# Altium schematic sheet RECEPTOR.SchDoc
size A
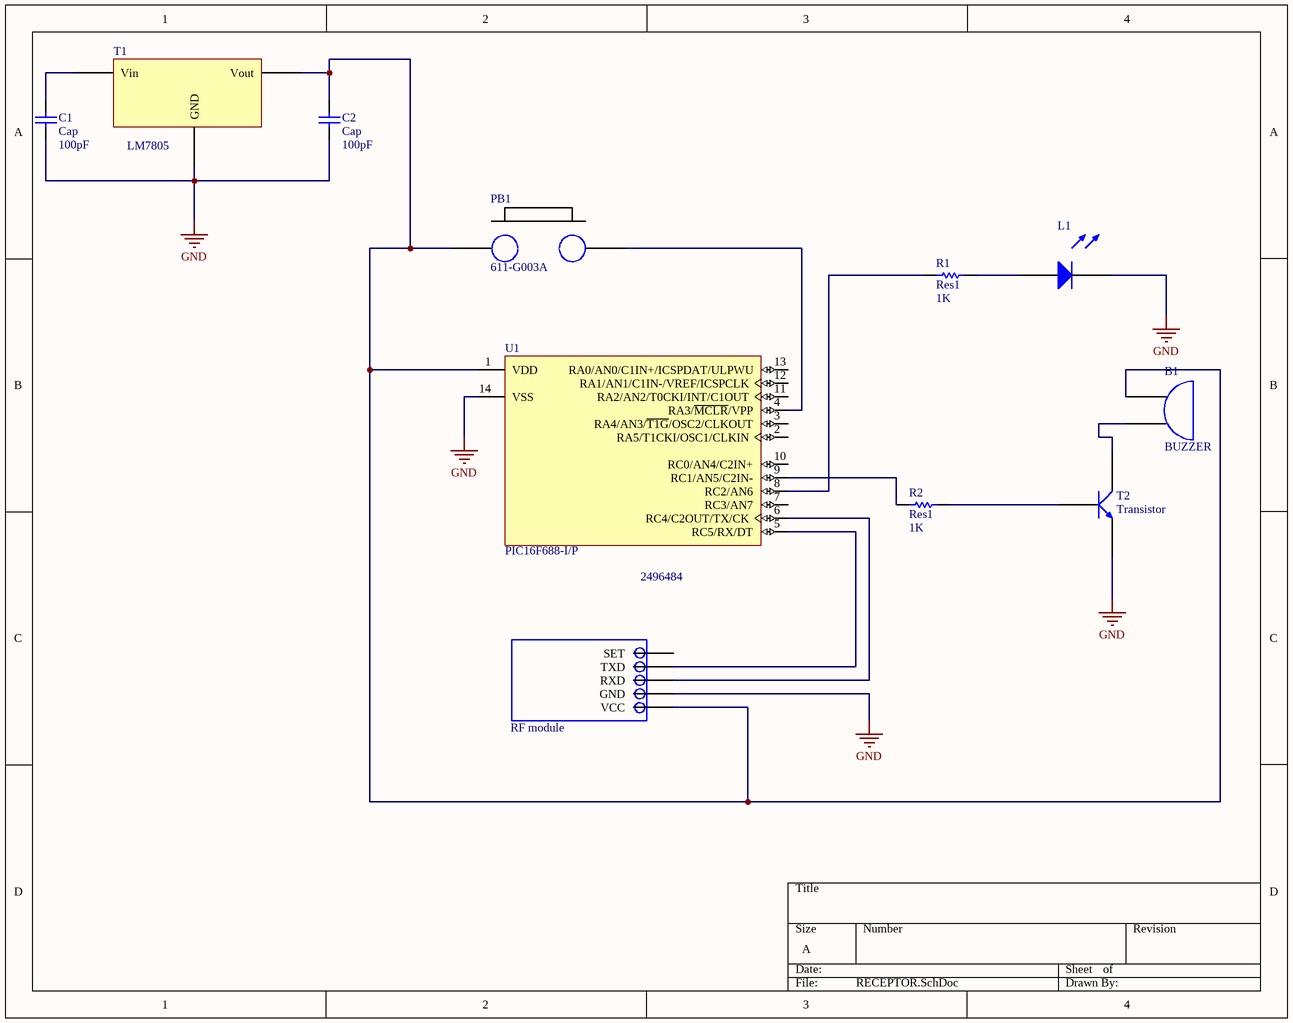
[diagram p0: RECEPTOR.SchDoc]

## Parts
B1  BUZZER  [Buzzer]
C1  Cap  value 100pF  [RAD-0.3]
C2  Cap  value 100pF  [RAD-0.3]
L1  LED  [LED]  (value not drawn)
PB1  Supplier Part Number 1: 611-G003A  [Push Button]  (hidden comment: Push Button 2-Pin)
R1  Res1  value 1K  [AXIAL-0.3]
R2  Res1  value 1K  [AXIAL-0.3]
T1  LM7805  [LM7805]
T2  Transistor  [2N2222a]
U1  PIC16F688-I/P  [PDIP300-P14]
U2  RF module  Supplier Part Number 1: 2496484  [HC-12]

## Nets
GND: C1.1 C2.1 L1.2 T1.174(GND) T2.34(E) U1.14(VSS) U2.4(GND)
NetB1_1: B1.1(VCC) C2.2 PB1.1 T1.175(Vout) U1.1(VDD) U2.5(VCC)
NetB1_36: B1.36(VEE) T2.1(C)
NetC1_2: C1.2 T1.173(Vin)
NetL1_1: L1.1 R1.2
NetPB1_2: PB1.2 U1.4(RA3/~{MCLR}/VPP)
NetR1_1: R1.1 U1.8(RC2/AN6)
NetR2_1: R2.1 U1.9(RC1/AN5/C2IN-)
NetR2_2: R2.2 T2.33(B)
NetU1_5: U1.5(RC5/RX/DT) U2.2(TXD)
NetU1_6: U1.6(RC4/C2OUT/TX/CK) U2.3(RXD)

Not connected (* = marked no-connect by the designer): U1 2(RA5/T1CKI/OSC1/CLKIN) 3(RA4/AN3/~{T1G}/OSC2/CLKOUT) 7(RC3/AN7) 10(RC0/AN4/C2IN+) 11(RA2/AN2/T0CKI/INT/C1OUT) 12(RA1/AN1/C1IN-/VREF/ICSPCLK) 13(RA0/AN0/C1IN+/ICSPDAT/ULPWU); U2 1(SET)

## Library data of the parts
B1 = BUZZER: Buzzer 3-12V; Manufacturer: Murata; Manufacturer Part Number: PKB24SPCH3601-B0; Frequency: 3.6kHz; Max Supply Voltage: 15V; Voltage Rating: 12V; Min Supply Voltage: 3V; Max Frequency: 4.1kHz; Nominal Supply Current: 16mA; Washable: No; Supplier 1: RSComponents; Stock 1: 0; Mount: Flush,PCB,Through Hole; Min Operating Temperature: -20°C; Max Operating Temperature: 70°C; Termination: PC Pins; Self Resonant Frequency: 3.6kHz; Package Quantity: 650; Packaging: Bulk; Voltage Rating (DC): 15V; Nominal Supply Voltage (DC): 12V; Max Supply Voltage (DC): 15V; Min Supply Voltage (DC): 3V; Operating Supply Current: 16mA; Max Supply Current: 16mA; Diameter: 24.3mm; Length: 24.3mm; Height: 9.7mm; Radiation Hardening: No; REACH SVHC: No SVHC; Lead Free: Lead Free; Supplier Part Number 1: 5168274P
C1 C2 = Cap: Capacitor Ceramico; Manufacturer: KEMET; Manufacturer Part Number: C0402C104K8PACTU; Capacitance: 100nF; Tolerance: 10%; Voltage Rating: 10V; Dielectric: X5R; Dissipation Factor: 5%; Published: 8-Jun-2000; LatestRevisionDate: 17-Jul-2002; LatestRevisionNote: Re-released for DXP Platform.; PackageReference: RAD-0.3; Publisher: Altium Limited; PackageDescription: Radial Cap, Thru-Hole; 2 Leads; 0.3 in Pin Spacing; Supplier 1: Arrow; Stock 1: 0; Mount: PCB,Surface Mount; Case/Package: 0402; Number of Pins: 2; Case Code (Metric): 1005; Case Code (Imperial): 0402; Dielectric Material: Ceramic; Contact Plating: Matte,Tin; Min Operating Temperature: -55°C; Max Operating Temperature: 85°C; Voltage Rating (DC): 10V; Package Quantity: 1; Packaging: Tape and Reel; Termination: SMD/SMT; Voltage: 10V; Length: 1mm; Height: 0.5mm; Width: 0.02inch; Depth: 0.5mm; Thickness: 0.022inch; Lead Pitch: 0.3mm; Radiation Hardening: No; REACH SVHC: No SVHC; Lead Free: Lead Free; Supplier Part Number 1: C0402C104K8PAC7867
L1 = LED: Manufacturer: Vishay Lite-On; Manufacturer Part Number: LTST-C190GKT; Colour: Green; Lens Colour: Clear,Colorless; Luminous Intensity: 6mcd; Forward Voltage: 2.1V; Viewing Angle: 130°; Lens Style: Clear,Colorless,Diffused,Rectangular; Forward Current: 30mA; Test Current: 10mA; Number of Elements: 1; Power Dissipation: 100mW; Reverse Voltage: 5V; Dominant Wavelength: 569nm; Wavelength: 565nm; Lens Transparency: Clear; Voltage: 2V; Current: 1A; Supplier 1: Mouser; Stock 1: 402291; Pricing 1: 1=0.25, 10=0.13, 50=0.13, 100=0.061, 1000=0.045, 10000=0.034 (USD); Mount: Surface Mount; Case/Package: 0603; Number of Pins: 2; Case Code (Metric): 1608; Case Code (Imperial): 0603; Min Operating Temperature: -55°C; Max Operating Temperature: 85°C; Package Quantity: 1; Packaging: Tape and Reel; Illumination Colour: Green; Number of LEDs: 1; Power Rating: 100mW; Length: 1.6mm; Height: 0.8mm; Width: 0.8mm; Depth: 0.8mm; Radiation Hardening: No; Lead Free: Lead Free; Supplier Part Number 1: 859-LTST-C190GKT
PB1 = Push button: Manufacturer: ITT C&K; Manufacturer Part Number: G003A; Shape: Round; Illumination Type: Non-Illuminated; Illumination Colour: Black; Supplier 1: Mouser; Stock 1: 2542; Pricing 1: 1=0.44, 10=0.44, 50=0.425, 100=0.416, 1000=0.296, 10000=0.28 (USD); Colour: Black; Packaging: Bulk; Package Quantity: 500; Diameter: 6.2mm; Height: 9.04mm; Radiation Hardening: No; Lead Free: Lead Free
R1 R2 = Res1: Resistor; Published: 8-Jun-2000; LatestRevisionDate: 17-Jul-2002; LatestRevisionNote: Re-released for DXP Platform.; PackageReference: AXIAL-0.3; Publisher: Altium Limited; PackageDescription: Axial Device, Thru-Hole; 2 Leads; 0.3 in Pin Spacing
T1 = LM7805: Voltage Regulator; Manufacturer: ON Semiconductor / Fairchild; Manufacturer Part Number: LM7805CT; Output Voltage: 5V; Number of Outputs: 1; Max Input Voltage: 35V; Polarity: Positive; Output Type: Fixed; Output Current: 1A; Min Input Voltage: 7V; Quiescent Current: 8mA; Dropout Voltage: 2V; Accuracy: 4%; Power Supply Rejection Ratio (PSRR): 73dB; Max Output Voltage: 5.2V; Supplier 1: Newark; Stock 1: 0; Mount: Through Hole; Case/Package: TO-220-3; Number of Pins: 3; Weight: 1.214g; Min Operating Temperature: -40°C; Max Operating Temperature: 125°C; Packaging: Rail/Tube; Package Quantity: 50; Number of Regulators: 1; Output Voltage Accuracy: 4%; Max Output Current: 1A; Current Rating: 1A; Nominal Output Voltage: 5V; Min Output Voltage: 5V; Length: 10.67mm; Height: 16.3mm; Width: 4.7mm; Radiation Hardening: No; Lead Free: Lead Free; REACH SVHC: No SVHC; Supplier Part Number 1: 34C1092
T2 = 2N2222A: Manufacturer: NTE Electronics; Polarity: NPN; Collector Emitter Breakdown Voltage: 40V; Max Power Dissipation: 1.2W; Transition Frequency: 300MHz; Supplier 1: Allied Electronics; Manufacturer Part Number: 2N2222A; Stock 1: 4414; Pricing 1: 1=0.48 (USD); Case/Package: TO-18; Number of Pins: 3; Max Operating Temperature: 200°C; Collector Emitter Voltage (VCEO): 40V; Lead Free: Contains Lead; REACH SVHC: No SVHC; Supplier Part Number 1: 70725575
U1 = PIC16F688-I/P: FLASH-Based 8-Bit CMOS Microcontroller, 10-Bit A/D, 4K (x14-Bit words) FLASH, 256 Bytes SRAM, 14-Pin PDIP, Industrial Temperature; Published: 11-Oct-2004; LatestRevisionDate: 29-Jan-2009; LatestRevisionNote: Sch. layout revised. 3D Model Removed.; DatasheetVersion: revD, Feb-2007; PackageVersion: revBB, Aug-2009; PackageReference: PDIP300-P14; Publisher: Altium Limited; PackageDescription: 14-Lead Plastic Dual In-Line (P) - 300 mil Body [PDIP]; Supplier 1: Digi-Key; Supplier Part Number 1: PIC16F688-I/P-ND; ComponentLink1Description: Datasheet; ComponentLink1URL: http://ww1.microchip.com/downloads/en/DeviceDoc/41203D.pdf; ComponentLink2Description: Packaging Specification; ComponentLink2URL: http://www.microchip.com/stellent/groups/techpub_sg/documents/packagingspec/en012702.pdf; ComponentLink3Description: Microchip.com Home; ComponentLink3URL: http://www.microchip.com/
U2 = HC-12: HC-11 1000m; Manufacturer: Microchip; Manufacturer Part Number: MRF89XAM8A-I/RM; Max Supply Voltage: 3.6V; Min Supply Voltage: 2.1V; Operating Supply Voltage: 3.3V; Data Rate: 40Kbps; Number of Channels: 59; Nominal Supply Current: 25mA; Interface: SPI; Frequency: 870MHz; Sensitivity: -113dBm; Current - Receiving: 3mA; Logic Function: Transceiver; Propagation Delay: 25ns; Number of Transmitters: 1; Simplex/Duplex: Half Duplex; Operating Supply Current: 18mA; Mount: Surface Mount; Case/Package: Module; Number of Pins: 12; Contact Plating: Matte,Tin; Min Operating Temperature: -40°C; Max Operating Temperature: 85°C; Packaging: Tray; Package Quantity: 54; Max Frequency: 870MHz; Current - Transmitting: 25mA; Length: 27.94mm; Height: 0.075inch; Width: 0.7inch; Depth: 17.78mm; Radiation Hardening: No; Lead Free: Lead Free; REACH SVHC: No SVHC; Supplier 1: Farnell; Stock 1: 13; Pricing 1: 1=49.59, 5=48.04, 10=47.12, 25=40.3 (GBP); Weight: 0.004706oz; Number of Receivers: 1; Number of Drivers: 1; Number of Transceivers: 1